# Altium project main.PrjPcb
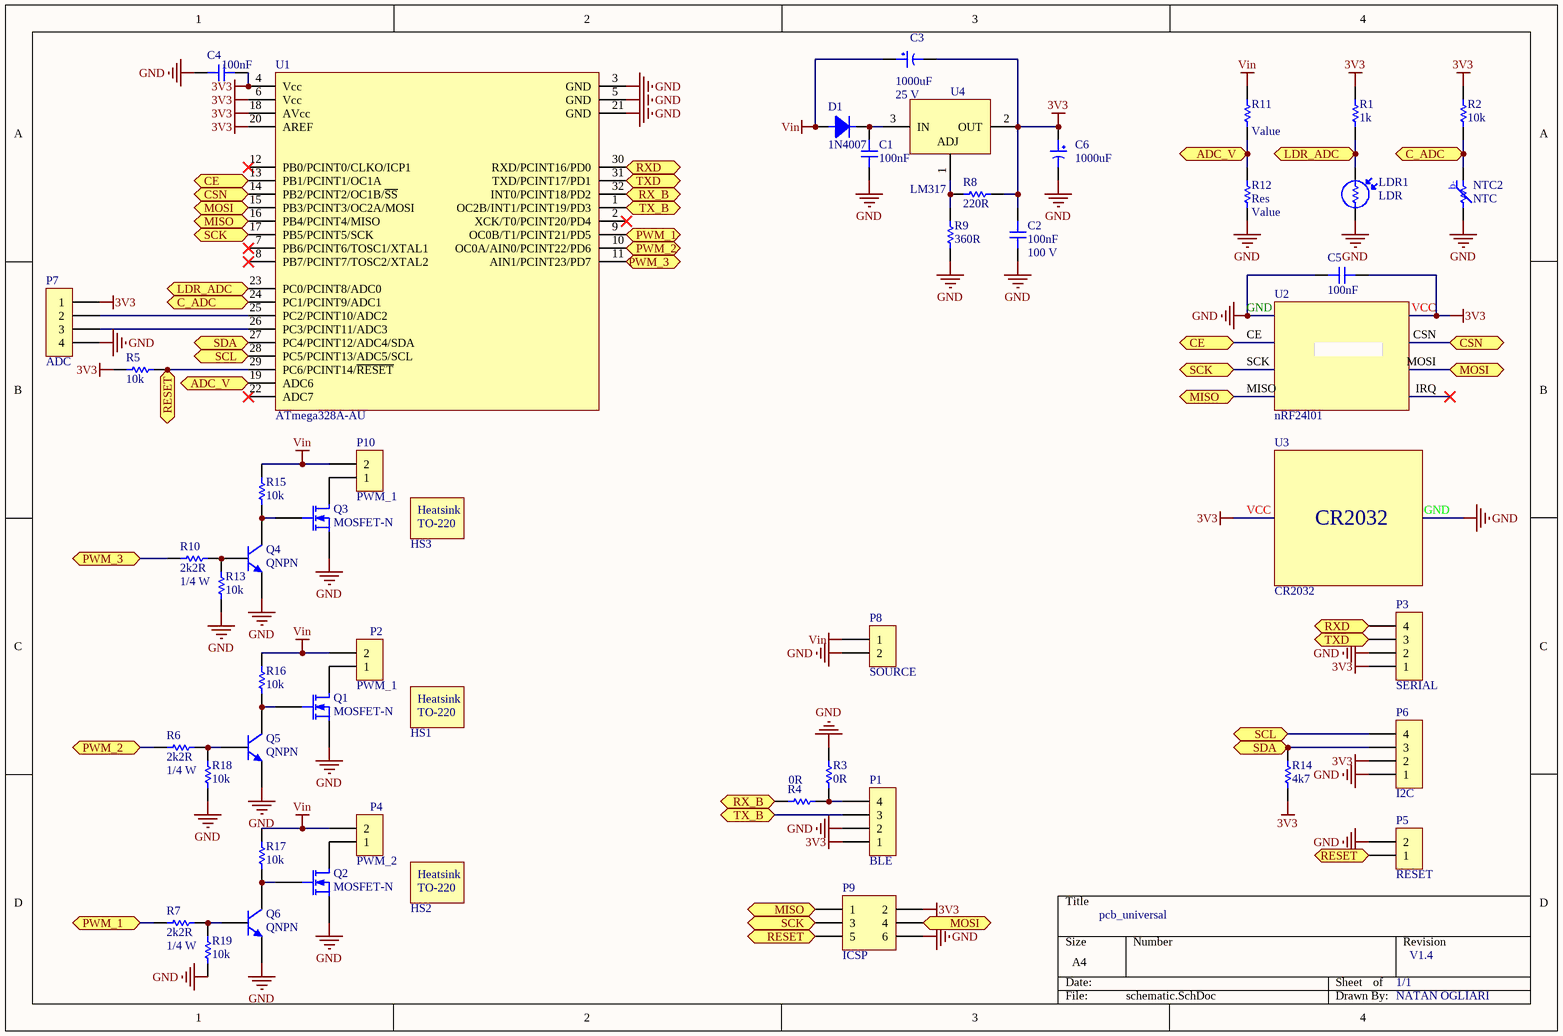
[diagram p0: schematic.SchDoc]
1 sheet, 51 parts. Net scope: flat (ports and power ports of the same name join across sheets).
Board file: PCB.PcbDoc

## Sheet schematic.SchDoc
size A4; PageSetup: Record=PageOptions|CenterHorizontal=True|CenterVertical=True|PrintScale=1.00|XCorrection=1.00|YCorrection=1.00|PrintKind=0|BorderSize=5000000|LeftOffset=0|BottomOffset=0|Orientation=2|PaperLength=1000|PaperWidth=1000|Scale=100|PaperSource=7|PrintQuality=-3|MediaType=1|DitherType=10|PrintScaleMode=1|PaperKind=A4|PaperIndex=9

### Parts
C1  100nF  [0805C]
C2  100nF  Voltage: 100 V  [0805C]
C3  1000uF  Voltage: 25 V  [CP-RAD-12.5mm-25.0mm-5.0mm]
C4  100nF  [0805C]
C5  100nF  [0805C]
C6  1000uF  [CP-RAD-12.5mm-40.0mm-5.0mm]
D1  1N4007  [DO-214AC]
HS1  HS-TO-220  [HS-TO-220-180847]  (value not drawn)
HS2  HS-TO-220  [HS-TO-220-180847]  (value not drawn)
HS3  HS-TO-220  [HS-TO-220-180847]  (value not drawn)
LDR1  LDR  [LDR-5mm]
NTC2  NTC  [Thermistor-100mil]
P1  BLE  [HDR-F-1x4-2.54mm-180-8.7mm]
P2  PWM_1  [HDR-M-1x2-2.54mm-180-9.2mm]
P3  SERIAL  [HDR-M-1x4-2.54mm-180-11.2mm]
P4  PWM_2  [HDR-M-1x2-2.54mm-180-9.2mm]
P5  RESET  [HDR-M-1x2-2.54mm-180-9.2mm]
P6  I2C  [HDR-M-1x4-2.54mm-180-11.2mm]
P7  ADC  [HDR-M-1x4-2.54mm-180-11.2mm]
P8  SOURCE  [KK-M-1x2-2.54mm-180]
P9  ICSP  [HDR-M-2x3-2.54mm-180-9.2mm]
P10  PWM_1  [HDR-M-1x2-2.54mm-180-9.2mm]
Q1  MOSFET-N  [TO-220/123]
Q2  MOSFET-N  [TO-220/123]
Q3  MOSFET-N  [TO-220/123]
Q4  QNPN  [SOT-23B_N]
Q5  QNPN  [SOT-23B_N]
Q6  QNPN  [SOT-23B_N]
R1  1k  [0805R]
R2  10k  [0805R]
R3  0R  [0805R]
R4  0R  [0805R]
R5  10k  [0805R]
R6  2k2R  Power: 1/4 W  [0805R]
R7  2k2R  Power: 1/4 W  [0805R]
R8  220R  [0805R]
R9  360R  [0805R]
R10  2k2R  Power: 1/4 W  [0805R]
R11  Res  [0805R]  (value not drawn)
R12  Res  [0805R]
R13  10k  [0805R]
R14  4k7  [0805R]
R15  10k  [0805R]
R16  10k  [0805R]
R17  10k  [0805R]
R18  10k  [0805R]
R19  10k  [0805R]
U1  ATmega328A-AU  [TQFP32-7.0mm(0.8mm)]
U2  nRF24l01  [nRF24l01]
U3  CR2032  [CR2032]
U4  LM317  [SOT-223/4]

### Ports
ADC_V, C_ADC, CE, CSN, LDR_ADC, MISO, MOSI, PWM_1, PWM_2, PWM_3, RESET, RX_B, RXD, SCK, SCL, SDA, TX_B, TXD

### Nets
3V3: C2.2 C3.2 C4.2 C5.1 C6.1 P1.1 P3.1 P6.2 P7.1 P9.2 R1.2 R2.2 R5.1 R8.2 R14.1 U1.4(Vcc) U1.6(Vcc) U1.18(AVcc) U1.20(AREF) U2.VCC U3.VCC U4.2(OUT)
GND: C1.1 C2.1 C4.1 C5.2 C6.2 LDR1.2 NTC2.2 P1.2 P3.2 P5.2 P6.1 P7.4 P8.2 P9.6 Q1.3(S) Q2.3(S) Q3.3(S) Q4.3(E) Q5.3(E) Q6.3(E) R3.2 R9.1 R12.1 R13.1 R18.1 R19.1 U1.3(GND) U1.5(GND) U1.21(GND) U2.GND U3.GND
Vin: C3.1 D1.A P2.2 P4.2 P8.1 P10.2 R11.2 R15.2 R16.2 R17.2
NetC1_2: C1.2 D1.K U4.3(IN)
NetLDR1_1: LDR1.1 R1.1 U1.23(PC0/PCINT8/ADC0) ; port LDR_ADC
NetNTC2_1: NTC2.1 R2.1 U1.24(PC1/PCINT9/ADC1) ; port C_ADC
NetP1_3: P1.3 U1.1(OC2B/INT1/PCINT19/PD3) ; port TX_B
NetP1_4: P1.4 R3.1 R4.2
NetP2_1: P2.1 Q1.1(D)
NetP3_3: P3.3 U1.31(TXD/PCINT17/PD1) ; port TXD
NetP3_4: P3.4 U1.30(RXD/PCINT16/PD0) ; port RXD
NetP4_1: P4.1 Q2.1(D)
NetP5_1: P5.1 P9.5 R5.2 U1.29(PC6/PCINT14/~{RESET}) ; port RESET
NetP6_3: P6.3 R14.2 U1.27(PC4/PCINT12/ADC4/SDA) ; port SDA
NetP6_4: P6.4 U1.28(PC5/PCINT13/ADC5/SCL) ; port SCL
NetP7_2: P7.2 U1.25(PC2/PCINT10/ADC2)
NetP7_3: P7.3 U1.26(PC3/PCINT11/ADC3)
NetP9_1: P9.1 U1.16(PB4/PCINT4/MISO) U2.MISO ; port MISO
NetP9_3: P9.3 U1.17(PB5/PCINT5/SCK) U2.SCK ; port SCK
NetP9_4: P9.4 U1.15(PB3/PCINT3/OC2A/MOSI) U2.MOSI ; port MOSI
NetP10_1: P10.1 Q3.1(D)
NetQ1_2: Q1.2(G) Q5.1(C) R16.1
NetQ2_2: Q2.2(G) Q6.1(C) R17.1
NetQ3_2: Q3.2(G) Q4.1(C) R15.1
NetQ4_2: Q4.2(B) R10.2 R13.2
NetQ5_2: Q5.2(B) R6.2 R18.2
NetQ6_2: Q6.2(B) R7.2 R19.2
NetR4_1: R4.1 U1.32(INT0/PCINT18/PD2) ; port RX_B
NetR6_1: R6.1 U1.10(OC0A/AIN0/PCINT22/PD6) ; port PWM_2
NetR7_1: R7.1 U1.9(OC0B/T1/PCINT21/PD5) ; port PWM_1
NetR8_1: R8.1 R9.2 U4.1(ADJ)
NetR10_1: R10.1 U1.11(AIN1/PCINT23/PD7) ; port PWM_3
NetR11_1: R11.1 R12.2 U1.19(ADC6) ; port ADC_V
NetU1_13: U1.13(PB1/PCINT1/OC1A) U2.CE ; port CE
NetU1_14: U1.14(PB2/PCINT2/OC1B/~{SS}) U2.CSN ; port CSN

Not connected (* = marked no-connect by the designer): U1 2(XCK/T0/PCINT20/PD4)* 7(PB6/PCINT6/TOSC1/XTAL1)* 8(PB7/PCINT7/TOSC2/XTAL2)* 12(PB0/PCINT0/CLKO/ICP1)* 22(ADC7)*; U2 IRQ*

### Notes on the sheet
- pcb_universal
- 1/1
- V1.4
- NATAN OGLIARI
- (in symbol HS-TO-220) Heatsink; TO-220
- (in symbol NTC) -q

### Library data of the parts
C1 C4 C5 = Capacitor: Voltage: 100 V; Published: 8-Jun-2000; LatestRevisionDate: 17-Jul-2002; LatestRevisionNote: Re-released for DXP Platform.; PackageReference: RAD-0.3; Publisher: Altium Limited
C2 = Capacitor: Published: 8-Jun-2000; LatestRevisionDate: 17-Jul-2002; LatestRevisionNote: Re-released for DXP Platform.; PackageReference: RAD-0.3; Publisher: Altium Limited
C3 = Capacitor-Electrolytic: Electrolytic Capacitor
C6 = Capacitor-Electrolytic: Electrolytic Capacitor; Voltage: 25 V
D1 = RS1A: 1 A Fast Rectifier; Forward Current (If): 1 A; Forward Voltage (Vf): 1.3 V; Max Recovery Time (trr): 150ns; Non-Repetitive Peak Forward Surge Current (Ifsm): 30 A; Peak Repetitive Reverse Voltage (Vrrm): 50 V; Reverse Current (Ir): 50 uA; Total Capacitance (Ct): 10 pF
HS1-HS3 = HS-TO-220: Heatsink TO-220
LDR1 = LDR: Ligh Dependant Resistor
NTC2 = NTC: Negative Temperature Coefficient Thermistor
P1 P3 P6 P7 = Header_1x4: Header, 1 Line, 4 Columns, 4 Pins; LatestRevisionDate: 17-Jul-2002; LatestRevisionNote: Re-released for DXP Platform.; Publisher: Altium Limited
P2 P4 P5 P10 = Header_1x2: Header, 1 Line, 2 Columns, 2 Pins; LatestRevisionDate: 17-Jul-2002; LatestRevisionNote: Re-released for DXP Platform.; Publisher: Altium Limited
P8 = KK_1x2: KK Header, 1 Line, 2 Columns, 2 Pins; LatestRevisionDate: 17-Jul-2002; LatestRevisionNote: Re-released for DXP Platform.; Publisher: Altium Limited
P9 = Header_2x3: Header, 2 Lines, 3 Columns, 6 Pins; LatestRevisionDate: 17-Jul-2002; LatestRevisionNote: Re-released for DXP Platform.; Publisher: Altium Limited
Q1-Q3 = MOSFET-N: N-Channel MOSFET; pin to pad: 1>2 2>1; Published: 8-Jun-2000; LatestRevisionDate: 17-Jul-2002; LatestRevisionNote: Re-released for DXP Platform.; PackageVersion: 1995/1996; PackageReference: E3; Publisher: Altium Limited; PackageDescription: TO, Flat Index; 3 In-Line, Axial Leads; Body Dia. 4.6mm; Lead Dia. 0.5 mm (max)
Q4-Q6 = QNPN: NPN Bipolar Transistor; Published: 8-Jun-2000; LatestRevisionDate: 29-May-2009; LatestRevisionNote: IPC-7351 Footprint Added.; PackageVersion: Aug-1999; PackageReference: SOT-23B; Publisher: Altium Limited; PackageDescription: 3-Pin SOT-23 Package 0.95 mm Pitch, 2.4 mm Lead Span
R1-R5 R8 R9 R13-R19 = Resistor: Tolerance: 5%; Power: 1/4 W; Published: 8-Jun-2000; LatestRevisionDate: 17-Jul-2002; LatestRevisionNote: Re-released for DXP Platform.; PackageReference: AXIAL-0.3; Publisher: Altium Limited
R6 R7 R10 = Resistor: Tolerance: 5%; Published: 8-Jun-2000; LatestRevisionDate: 17-Jul-2002; LatestRevisionNote: Re-released for DXP Platform.; PackageReference: AXIAL-0.3; Publisher: Altium Limited
R11 R12 = Res1: Resistor; Published: 8-Jun-2000; LatestRevisionDate: 17-Jul-2002; LatestRevisionNote: Re-released for DXP Platform.; PackageReference: AXIAL-0.3; Publisher: Altium Limited; PackageDescription: Axial Device, Thru-Hole; 2 Leads; 0.3 in Pin Spacing; Value: Value
U1 = ATmega328A-AU: 8-bit AVR Microcontroller with 32 KB In-System Programmable Flash; Flash Memory: 32 KB; EEPROM Memory: 1 KB; SRAM Memory: 2 KB; Timer 8 bits: 2; Timer 16 bits: 1; PWM Channel: 6; ADC Channel: 8; I/O Pins: 23; Supply Voltage (Vdd): 1.8 - 5.5 V; Clock Frequency: 0 - 20 MHz; Debug: debugWire; Serial USART: 1; Serial SPI: 1; Serial I2C: 1; Analog Comparator: 1
U4 = LM317: 3-Terminal 1.5 A Positive Adjustable Voltage Regulator